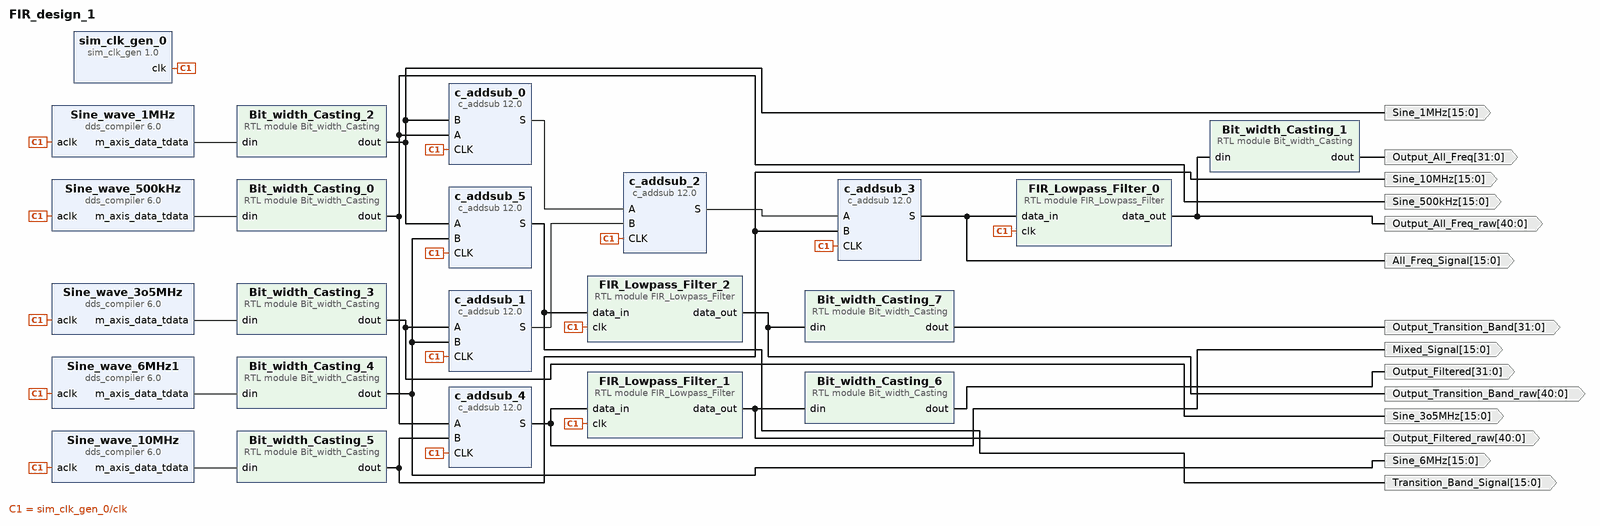
[diagram p0: block diagram of the top level]
# Vivado block design FIR_design_1, xc7k70tfbv676-1, Vivado 2023.2
create_bd_design FIR_design_1

create_bd_port -dir O -from 31 -to 0 Output_Transition_Band
create_bd_port -dir O -from 40 -to 0 Output_Transition_Band_raw
create_bd_port -dir O -from 15 -to 0 Transition_Band_Signal
create_bd_port -dir O -from 31 -to 0 Output_All_Freq
create_bd_port -dir O -from 40 -to 0 Output_All_Freq_raw
create_bd_port -dir O -from 15 -to 0 All_Freq_Signal
create_bd_port -dir O -from 31 -to 0 Output_Filtered
create_bd_port -dir O -from 40 -to 0 Output_Filtered_raw
create_bd_port -dir O -from 15 -to 0 Mixed_Signal
create_bd_port -dir O -from 15 -to 0 Sine_500kHz
create_bd_port -dir O -from 15 -to 0 Sine_1MHz
create_bd_port -dir O -from 15 -to 0 Sine_3o5MHz
create_bd_port -dir O -from 15 -to 0 Sine_6MHz
create_bd_port -dir O -from 15 -to 0 Sine_10MHz

create_bd_cell -type ip -vlnv xilinx.com:ip:dds_compiler:6.0 Sine_wave_500kHz
set_property -dict [list \
  CONFIG.Has_Phase_Out false \
  CONFIG.Latency 3 \
  CONFIG.Latency_Configuration Auto \
  CONFIG.M_DATA_Has_TUSER Not_Required \
  CONFIG.Output_Frequency1 0.5 \
  CONFIG.Output_Selection Sine \
  CONFIG.PINC1 101000111101011100001 \
] [get_bd_cells Sine_wave_500kHz]
create_bd_cell -type ip -vlnv xilinx.com:ip:dds_compiler:6.0 Sine_wave_10MHz
set_property -dict [list \
  CONFIG.Has_Phase_Out false \
  CONFIG.M_DATA_Has_TUSER Not_Required \
  CONFIG.Output_Frequency1 10 \
  CONFIG.Output_Selection Sine \
  CONFIG.PINC1 1100110011001100110011001 \
] [get_bd_cells Sine_wave_10MHz]
create_bd_cell -type ip -vlnv xilinx.com:ip:c_addsub:12.0 c_addsub_0
set_property -dict [list \
  CONFIG.A_Type Signed \
  CONFIG.A_Width 16 \
  CONFIG.Add_Mode Add \
  CONFIG.B_Constant false \
  CONFIG.B_Type Signed \
  CONFIG.B_Value 0000000000000000 \
  CONFIG.B_Width 16 \
  CONFIG.C_In false \
  CONFIG.Implementation Fabric \
  CONFIG.Latency 1 \
  CONFIG.Out_Width 16 \
] [get_bd_cells c_addsub_0]
create_bd_cell -type module -reference Bit_width_Casting Bit_width_Casting_0
set_property -dict {CONFIG.INPUT_WIDTH 8} [get_bd_cells Bit_width_Casting_0]
create_bd_cell -type module -reference FIR_Lowpass_Filter FIR_Lowpass_Filter_0
create_bd_cell -type module -reference Bit_width_Casting Bit_width_Casting_1
set_property -dict {CONFIG.INPUT_WIDTH 41 CONFIG.OUTPUT_WIDTH 32} [get_bd_cells Bit_width_Casting_1]
create_bd_cell -type ip -vlnv xilinx.com:ip:dds_compiler:6.0 Sine_wave_1MHz
set_property -dict [list \
  CONFIG.Has_Phase_Out false \
  CONFIG.M_DATA_Has_TUSER Not_Required \
  CONFIG.Output_Frequency1 1 \
  CONFIG.Output_Selection Sine \
  CONFIG.PINC1 1010001111010111000010 \
] [get_bd_cells Sine_wave_1MHz]
create_bd_cell -type ip -vlnv xilinx.com:ip:dds_compiler:6.0 Sine_wave_3o5MHz
set_property -dict [list \
  CONFIG.Has_Phase_Out false \
  CONFIG.M_DATA_Has_TUSER Not_Required \
  CONFIG.Output_Frequency1 3.5 \
  CONFIG.Output_Selection Sine \
  CONFIG.PINC1 100011110101110000101000 \
] [get_bd_cells Sine_wave_3o5MHz]
create_bd_cell -type ip -vlnv xilinx.com:ip:dds_compiler:6.0 Sine_wave_6MHz1
set_property -dict [list \
  CONFIG.Has_Phase_Out false \
  CONFIG.M_DATA_Has_TUSER Not_Required \
  CONFIG.Output_Frequency1 6 \
  CONFIG.Output_Selection Sine \
  CONFIG.PINC1 111101011100001010001111 \
] [get_bd_cells Sine_wave_6MHz1]
create_bd_cell -type module -reference Bit_width_Casting Bit_width_Casting_2
set_property -dict {CONFIG.INPUT_WIDTH 8} [get_bd_cells Bit_width_Casting_2]
create_bd_cell -type module -reference Bit_width_Casting Bit_width_Casting_3
set_property -dict {CONFIG.INPUT_WIDTH 8} [get_bd_cells Bit_width_Casting_3]
create_bd_cell -type module -reference Bit_width_Casting Bit_width_Casting_4
set_property -dict {CONFIG.INPUT_WIDTH 8} [get_bd_cells Bit_width_Casting_4]
create_bd_cell -type module -reference Bit_width_Casting Bit_width_Casting_5
set_property -dict {CONFIG.INPUT_WIDTH 8} [get_bd_cells Bit_width_Casting_5]
create_bd_cell -type ip -vlnv xilinx.com:ip:c_addsub:12.0 c_addsub_1
set_property -dict [list \
  CONFIG.A_Type Signed \
  CONFIG.A_Width 16 \
  CONFIG.Add_Mode Add \
  CONFIG.B_Constant false \
  CONFIG.B_Type Signed \
  CONFIG.B_Value 0000000000000000 \
  CONFIG.B_Width 16 \
  CONFIG.C_In false \
  CONFIG.Implementation Fabric \
  CONFIG.Latency 1 \
  CONFIG.Out_Width 16 \
] [get_bd_cells c_addsub_1]
create_bd_cell -type ip -vlnv xilinx.com:ip:c_addsub:12.0 c_addsub_2
set_property -dict [list \
  CONFIG.A_Type Signed \
  CONFIG.A_Width 16 \
  CONFIG.Add_Mode Add \
  CONFIG.B_Constant false \
  CONFIG.B_Type Signed \
  CONFIG.B_Value 0000000000000000 \
  CONFIG.B_Width 16 \
  CONFIG.C_In false \
  CONFIG.Implementation Fabric \
  CONFIG.Latency 1 \
  CONFIG.Out_Width 16 \
] [get_bd_cells c_addsub_2]
create_bd_cell -type ip -vlnv xilinx.com:ip:c_addsub:12.0 c_addsub_3
set_property -dict [list \
  CONFIG.A_Type Signed \
  CONFIG.A_Width 16 \
  CONFIG.Add_Mode Add \
  CONFIG.B_Constant false \
  CONFIG.B_Type Signed \
  CONFIG.B_Value 0000000000000000 \
  CONFIG.B_Width 16 \
  CONFIG.C_In false \
  CONFIG.Implementation Fabric \
  CONFIG.Latency 1 \
  CONFIG.Out_Width 16 \
] [get_bd_cells c_addsub_3]
create_bd_cell -type module -reference Bit_width_Casting Bit_width_Casting_6
set_property -dict {CONFIG.INPUT_WIDTH 41 CONFIG.OUTPUT_WIDTH 32} [get_bd_cells Bit_width_Casting_6]
create_bd_cell -type module -reference FIR_Lowpass_Filter FIR_Lowpass_Filter_1
create_bd_cell -type ip -vlnv xilinx.com:ip:c_addsub:12.0 c_addsub_4
set_property -dict [list \
  CONFIG.A_Type Signed \
  CONFIG.A_Width 16 \
  CONFIG.Add_Mode Add \
  CONFIG.B_Constant false \
  CONFIG.B_Type Signed \
  CONFIG.B_Value 0000000000000000 \
  CONFIG.B_Width 16 \
  CONFIG.C_In false \
  CONFIG.Implementation Fabric \
  CONFIG.Latency 1 \
  CONFIG.Out_Width 16 \
] [get_bd_cells c_addsub_4]
create_bd_cell -type ip -vlnv xilinx.com:ip:c_addsub:12.0 c_addsub_5
set_property -dict [list \
  CONFIG.A_Type Signed \
  CONFIG.A_Width 16 \
  CONFIG.Add_Mode Add \
  CONFIG.B_Constant false \
  CONFIG.B_Type Signed \
  CONFIG.B_Value 0000000000000000 \
  CONFIG.B_Width 16 \
  CONFIG.C_In false \
  CONFIG.Implementation Fabric \
  CONFIG.Latency 1 \
  CONFIG.Out_Width 16 \
] [get_bd_cells c_addsub_5]
create_bd_cell -type module -reference FIR_Lowpass_Filter FIR_Lowpass_Filter_2
create_bd_cell -type module -reference Bit_width_Casting Bit_width_Casting_7
set_property -dict {CONFIG.INPUT_WIDTH 41 CONFIG.OUTPUT_WIDTH 32} [get_bd_cells Bit_width_Casting_7]
create_bd_cell -type ip -vlnv xilinx.com:ip:sim_clk_gen:1.0 sim_clk_gen_0

# ---- connections ----

connect_bd_net [get_bd_pins Bit_width_Casting_0/dout] [get_bd_pins c_addsub_0/A] [get_bd_pins c_addsub_4/A] [get_bd_ports Sine_500kHz]
connect_bd_net [get_bd_pins Bit_width_Casting_1/dout] [get_bd_ports Output_All_Freq]
connect_bd_net [get_bd_pins Bit_width_Casting_2/dout] [get_bd_pins c_addsub_0/B] [get_bd_pins c_addsub_5/A] [get_bd_ports Sine_1MHz]
connect_bd_net [get_bd_pins Bit_width_Casting_3/dout] [get_bd_pins c_addsub_1/A] [get_bd_ports Sine_3o5MHz]
connect_bd_net [get_bd_pins Bit_width_Casting_4/dout] [get_bd_pins c_addsub_1/B] [get_bd_pins c_addsub_5/B] [get_bd_ports Sine_6MHz]
connect_bd_net [get_bd_pins Bit_width_Casting_5/dout] [get_bd_pins c_addsub_3/B] [get_bd_ports Sine_10MHz] [get_bd_pins c_addsub_4/B]
connect_bd_net [get_bd_pins Bit_width_Casting_6/dout] [get_bd_ports Output_Filtered]
connect_bd_net [get_bd_pins Bit_width_Casting_7/dout] [get_bd_ports Output_Transition_Band]
connect_bd_net [get_bd_pins FIR_Lowpass_Filter_0/data_out] [get_bd_pins Bit_width_Casting_1/din] [get_bd_ports Output_All_Freq_raw]
connect_bd_net [get_bd_pins FIR_Lowpass_Filter_1/data_out] [get_bd_pins Bit_width_Casting_6/din] [get_bd_ports Output_Filtered_raw]
connect_bd_net [get_bd_pins FIR_Lowpass_Filter_2/data_out] [get_bd_pins Bit_width_Casting_7/din] [get_bd_ports Output_Transition_Band_raw]
connect_bd_net [get_bd_pins Sine_wave_10MHz/m_axis_data_tdata] [get_bd_pins Bit_width_Casting_5/din]
connect_bd_net [get_bd_pins Sine_wave_1MHz/m_axis_data_tdata] [get_bd_pins Bit_width_Casting_2/din]
connect_bd_net -net Sine_wave_3o5MHz1_m_axis_data_tdata [get_bd_pins Sine_wave_6MHz1/m_axis_data_tdata] [get_bd_pins Bit_width_Casting_4/din]
connect_bd_net [get_bd_pins Sine_wave_3o5MHz/m_axis_data_tdata] [get_bd_pins Bit_width_Casting_3/din]
connect_bd_net [get_bd_pins Sine_wave_500kHz/m_axis_data_tdata] [get_bd_pins Bit_width_Casting_0/din]
connect_bd_net [get_bd_pins c_addsub_0/S] [get_bd_pins c_addsub_2/A]
connect_bd_net [get_bd_pins c_addsub_1/S] [get_bd_pins c_addsub_2/B]
connect_bd_net [get_bd_pins c_addsub_2/S] [get_bd_pins c_addsub_3/A]
connect_bd_net [get_bd_pins c_addsub_3/S] [get_bd_pins FIR_Lowpass_Filter_0/data_in] [get_bd_ports All_Freq_Signal]
connect_bd_net [get_bd_pins c_addsub_4/S] [get_bd_pins FIR_Lowpass_Filter_1/data_in] [get_bd_ports Mixed_Signal]
connect_bd_net [get_bd_pins c_addsub_5/S] [get_bd_pins FIR_Lowpass_Filter_2/data_in] [get_bd_ports Transition_Band_Signal]
connect_bd_net [get_bd_pins sim_clk_gen_0/clk] \
  [get_bd_pins Sine_wave_500kHz/aclk] [get_bd_pins Sine_wave_1MHz/aclk] [get_bd_pins Sine_wave_3o5MHz/aclk] \
  [get_bd_pins Sine_wave_6MHz1/aclk] [get_bd_pins Sine_wave_10MHz/aclk] [get_bd_pins FIR_Lowpass_Filter_0/clk] \
  [get_bd_pins c_addsub_2/CLK] [get_bd_pins c_addsub_0/CLK] [get_bd_pins c_addsub_1/CLK] [get_bd_pins c_addsub_3/CLK] \
  [get_bd_pins FIR_Lowpass_Filter_1/clk] [get_bd_pins c_addsub_4/CLK] [get_bd_pins c_addsub_5/CLK] \
  [get_bd_pins FIR_Lowpass_Filter_2/clk]

validate_bd_design
save_bd_design
